# Altium schematic sheet Carte_Alimentation.SchDoc: Schema Carte Alimentation
size A3; Organization: Altium Limited; Address1: L3, 12a Rodborough Rd; Address2: Frenchs Forest; Address3: NSW; Address4: Australia 2086
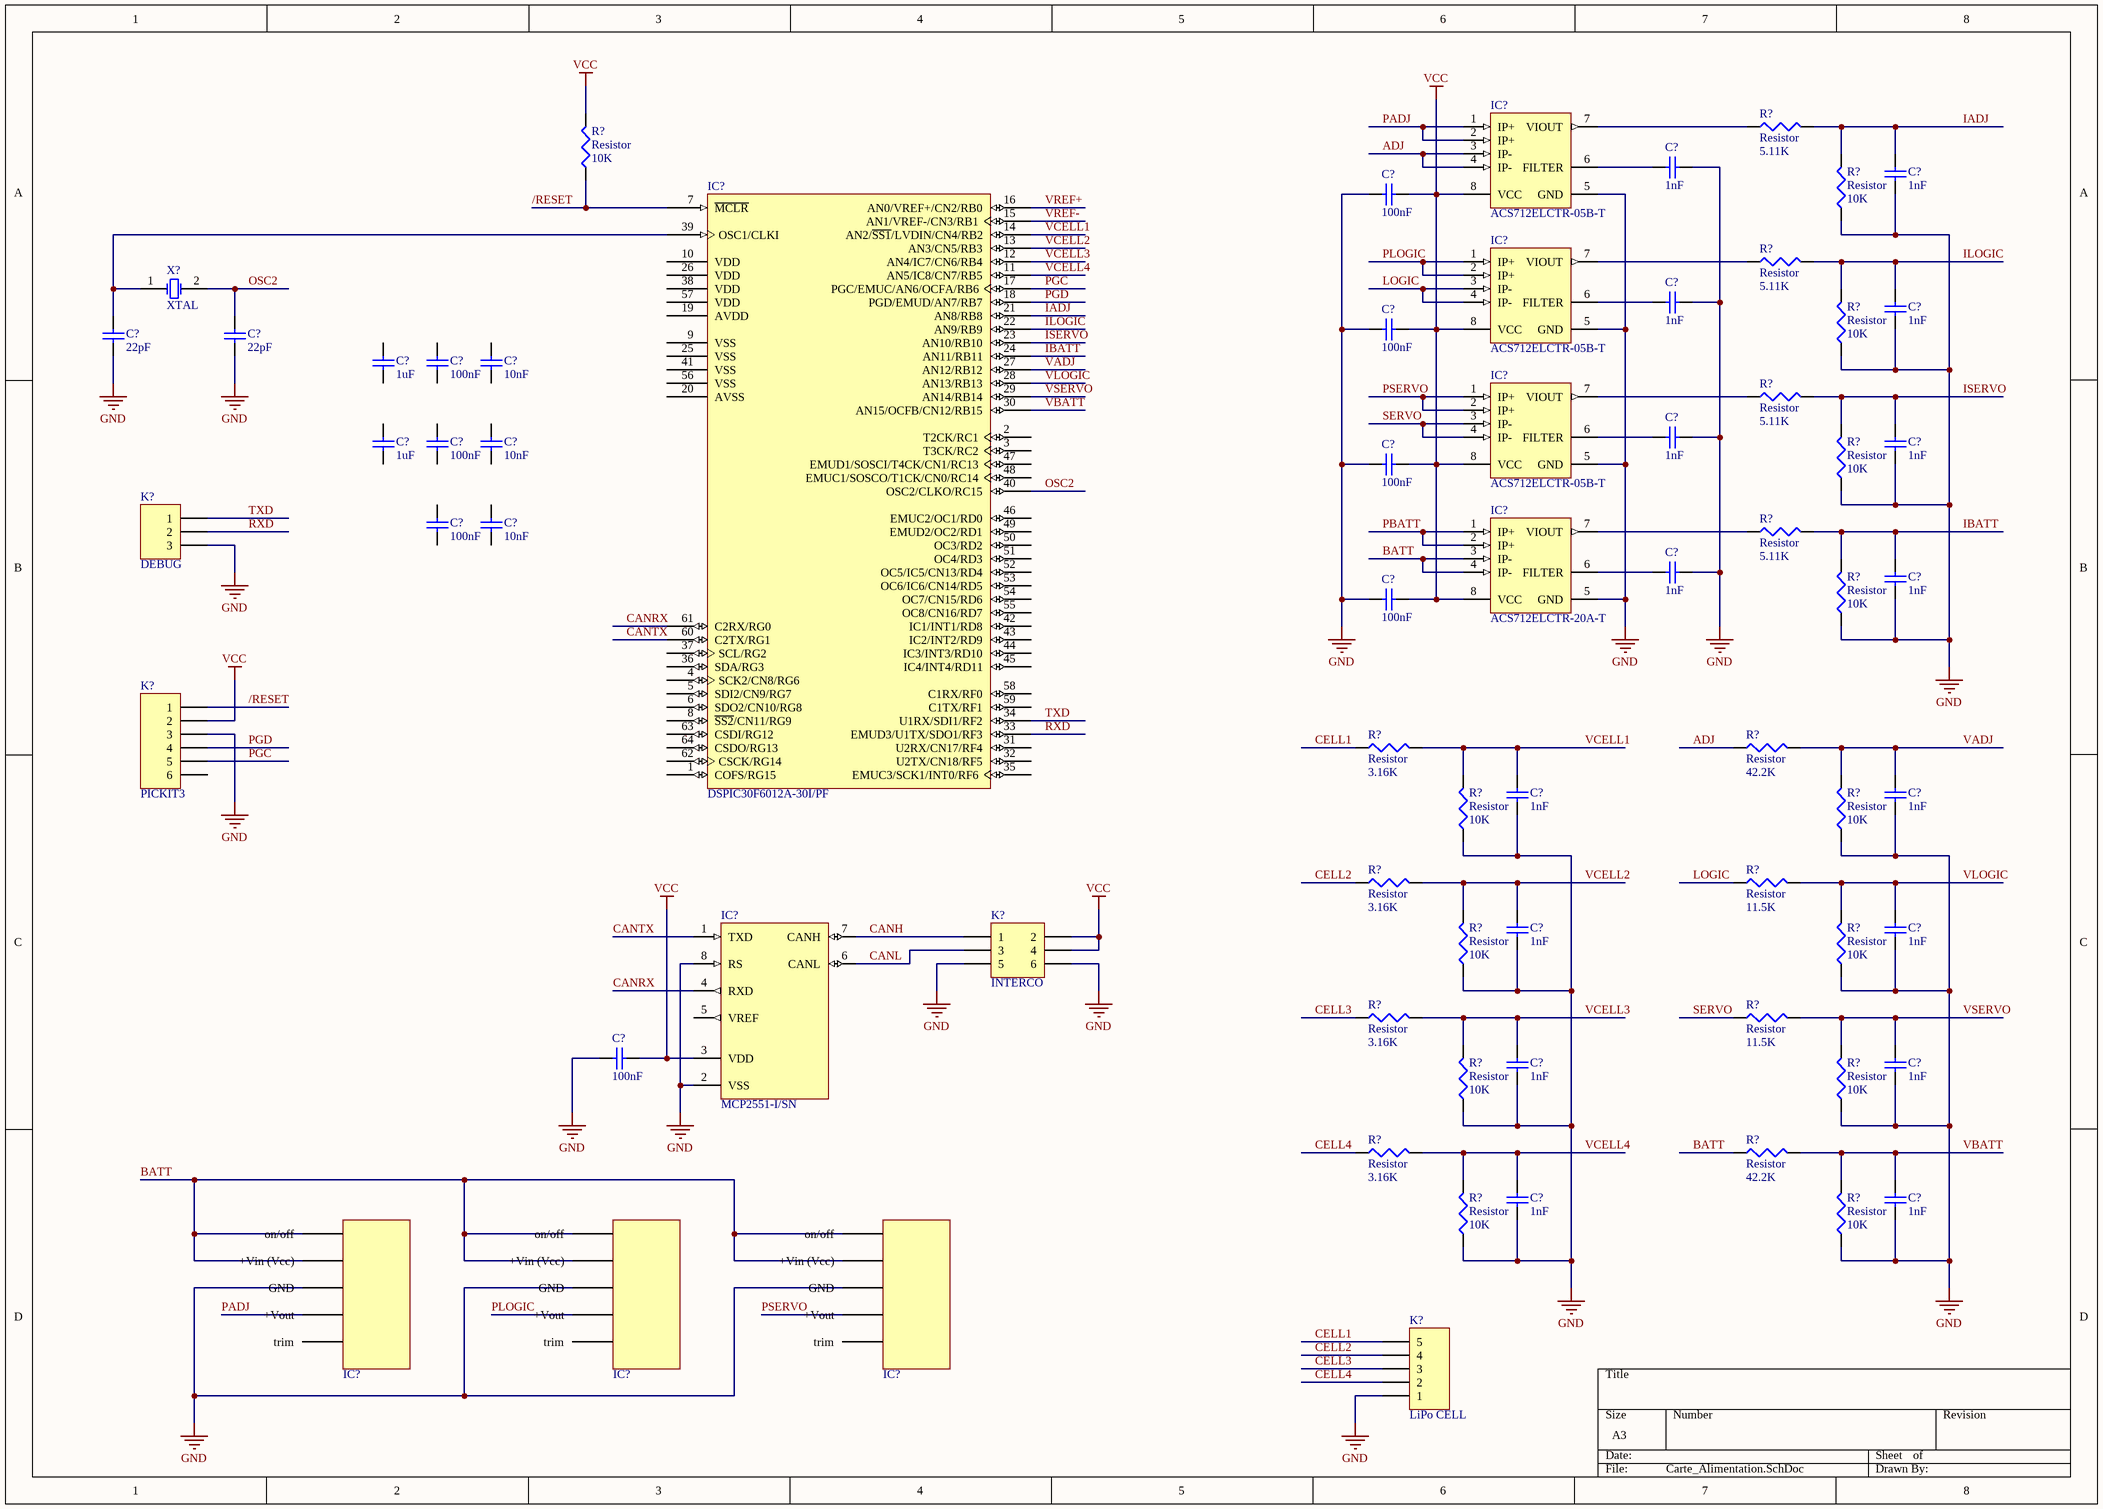
[diagram p0: Carte_Alimentation.SchDoc]

## Parts
(Parts that share a designator on the sheet are numbered #1, #2 ... from top to bottom, then left to right.)
C?#1  value 1nF  [Cap tantal 5mm pitch]  (hidden comment: Capacitor tantal)
C?#2  value 1nF  [Cap tantal 5mm pitch]  (hidden comment: Capacitor tantal)
C?#3  value 100nF  [Cap tantal 5mm pitch]  (hidden comment: Capacitor tantal)
C?#4  value 1nF  [Cap tantal 5mm pitch]  (hidden comment: Capacitor tantal)
C?#5  value 1nF  [Cap tantal 5mm pitch]  (hidden comment: Capacitor tantal)
C?#6  value 22pF  [Cap tantal 5mm pitch]  (hidden comment: Capacitor tantal)
C?#7  value 22pF  [Cap tantal 5mm pitch]  (hidden comment: Capacitor tantal)
C?#8  value 100nF  [Cap tantal 5mm pitch]  (hidden comment: Capacitor tantal)
C?#9  value 1uF  [Cap tantal 5mm pitch]  (hidden comment: Capacitor tantal)
C?#10  value 100nF  [Cap tantal 5mm pitch]  (hidden comment: Capacitor tantal)
C?#11  value 10nF  [Cap tantal 5mm pitch]  (hidden comment: Capacitor tantal)
C?#12  value 1uF  [Cap tantal 5mm pitch]  (hidden comment: Capacitor tantal)
C?#13  value 100nF  [Cap tantal 5mm pitch]  (hidden comment: Capacitor tantal)
C?#14  value 10nF  [Cap tantal 5mm pitch]  (hidden comment: Capacitor tantal)
C?#15  value 1nF  [Cap tantal 5mm pitch]  (hidden comment: Capacitor tantal)
C?#16  value 1nF  [Cap tantal 5mm pitch]  (hidden comment: Capacitor tantal)
C?#17  value 100nF  [Cap tantal 5mm pitch]  (hidden comment: Capacitor tantal)
C?#18  value 100nF  [Cap tantal 5mm pitch]  (hidden comment: Capacitor tantal)
C?#19  value 10nF  [Cap tantal 5mm pitch]  (hidden comment: Capacitor tantal)
C?#20  value 1nF  [Cap tantal 5mm pitch]  (hidden comment: Capacitor tantal)
C?#21  value 1nF  [Cap tantal 5mm pitch]  (hidden comment: Capacitor tantal)
C?#22  value 100nF  [Cap tantal 5mm pitch]  (hidden comment: Capacitor tantal)
C?#23  value 1nF  [Cap tantal 5mm pitch]  (hidden comment: Capacitor tantal)
C?#24  value 1nF  [Cap tantal 5mm pitch]  (hidden comment: Capacitor tantal)
C?#25  value 1nF  [Cap tantal 5mm pitch]  (hidden comment: Capacitor tantal)
C?#26  value 1nF  [Cap tantal 5mm pitch]  (hidden comment: Capacitor tantal)
C?#27  value 100nF  [Cap tantal 5mm pitch]  (hidden comment: Capacitor tantal)
C?#28  value 1nF  [Cap tantal 5mm pitch]  (hidden comment: Capacitor tantal)
C?#29  value 1nF  [Cap tantal 5mm pitch]  (hidden comment: Capacitor tantal)
C?#30  value 1nF  [Cap tantal 5mm pitch]  (hidden comment: Capacitor tantal)
C?#31  value 1nF  [Cap tantal 5mm pitch]  (hidden comment: Capacitor tantal)
IC?#1  ACS712ELCTR-05B-T  [ALEG-LC-8_V]
IC?#2  DSPIC30F6012A-30I/PF  [TQFP-PF64_N]
IC?#3  ACS712ELCTR-05B-T  [ALEG-LC-8_V]
IC?#4  ACS712ELCTR-05B-T  [ALEG-LC-8_V]
IC?#5  ACS712ELCTR-20A-T  [ALEG-LC-8_V]
IC?#6  MCP2551-I/SN  [SOIC-SN8_N]
IC?#7  TS3-24150  [SIP-5]  (value not drawn)
IC?#8  TS3-24150  [SIP-5]  (value not drawn)
IC?#9  TS3-24150  [SIP-5]  (value not drawn)
K?#1  DEBUG  [HDR1X3]
K?#2  PICKIT3  [HDR1X6]
K?#3  INTERCO  [HDR2X3]
K?#4  LiPo CELL  [HDR1X5]
R?#1  Resistor  value 5.11K  [0402]
R?#2  Resistor  value 10K  [0402]
R?#3  Resistor  value 10K  [0402]
R?#4  Resistor  value 5.11K  [0402]
R?#5  Resistor  value 10K  [0402]
R?#6  Resistor  value 5.11K  [0402]
R?#7  Resistor  value 10K  [0402]
R?#8  Resistor  value 5.11K  [0402]
R?#9  Resistor  value 10K  [0402]
R?#10  Resistor  value 3.16K  [0402]
R?#11  Resistor  value 42.2K  [0402]
R?#12  Resistor  value 10K  [0402]
R?#13  Resistor  value 10K  [0402]
R?#14  Resistor  value 3.16K  [0402]
R?#15  Resistor  value 11.5K  [0402]
R?#16  Resistor  value 10K  [0402]
R?#17  Resistor  value 10K  [0402]
R?#18  Resistor  value 3.16K  [0402]
R?#19  Resistor  value 11.5K  [0402]
R?#20  Resistor  value 10K  [0402]
R?#21  Resistor  value 10K  [0402]
R?#22  Resistor  value 3.16K  [0402]
R?#23  Resistor  value 42.2K  [0402]
R?#24  Resistor  value 10K  [0402]
R?#25  Resistor  value 10K  [0402]
X?  XTAL  [R38]

## Nets
GND: C?#1.1 C?#2.1 C?#3.2 C?#4.1 C?#5.1 C?#6.1 C?#7.1 C?#8.2 C?#15.1 C?#16.1 C?#17.2 C?#20.1 C?#21.1 C?#22.2 C?#23.1 C?#24.1 C?#25.1 C?#26.1 C?#27.2 C?#28.1 C?#29.1 C?#30.1 C?#31.1 IC?#1.5(GND) IC?#3.5(GND) IC?#4.5(GND) IC?#5.5(GND) IC?#6.2(VSS) IC?#6.8(RS) K?#1.3 K?#2.3 K?#3.5 K?#3.6 K?#4.1 R?#3.1 R?#5.1 R?#7.1 R?#9.1 R?#12.1 R?#13.1 R?#16.1 R?#17.1 R?#20.1 R?#21.1 R?#24.1 R?#25.1
VCC: C?#3.1 C?#8.1 C?#17.1 C?#22.1 C?#27.1 IC?#1.8(VCC) IC?#3.8(VCC) IC?#4.8(VCC) IC?#5.8(VCC) IC?#6.3(VDD) K?#2.2 K?#3.2 K?#3.4 R?#2.2
/RESET: IC?#2.7(~{MCLR}) K?#2.1 R?#2.1
ADJ: IC?#1.3(IP-) IC?#1.4(IP-) R?#11.1
BATT: IC?#5.3(IP-) IC?#5.4(IP-) R?#23.1
CANH: IC?#6.7(CANH) K?#3.1
CANL: IC?#6.6(CANL) K?#3.3
CANRX: IC?#2.61(C2RX/RG0) IC?#6.4(RXD)
CANTX: IC?#2.60(C2TX/RG1) IC?#6.1(TXD)
CELL1: K?#4.5 R?#10.1
CELL2: K?#4.4 R?#14.1
CELL3: K?#4.3 R?#18.1
CELL4: K?#4.2 R?#22.1
IADJ: C?#2.2 IC?#2.21(AN8/RB8) R?#1.2 R?#3.2
IBATT: C?#21.2 IC?#2.24(AN11/RB11) R?#8.2 R?#9.2
ILOGIC: C?#5.2 IC?#2.22(AN9/RB9) R?#4.2 R?#5.2
ISERVO: C?#16.2 IC?#2.23(AN10/RB10) R?#6.2 R?#7.2
LOGIC: IC?#3.3(IP-) IC?#3.4(IP-) R?#15.1
OSC2: C?#7.2 IC?#2.40(OSC2/CLKO/RC15) X?.2(OSC2)
PADJ: IC?#1.1(IP+) IC?#1.2(IP+)
PBATT: IC?#5.1(IP+) IC?#5.2(IP+)
PGC: IC?#2.17(PGC/EMUC/AN6/OCFA/RB6) K?#2.5
PGD: IC?#2.18(PGD/EMUD/AN7/RB7) K?#2.4
PLOGIC: IC?#3.1(IP+) IC?#3.2(IP+)
PSERVO: IC?#4.1(IP+) IC?#4.2(IP+)
RXD: IC?#2.33(EMUD3/U1TX/SDO1/RF3) K?#1.2
SERVO: IC?#4.3(IP-) IC?#4.4(IP-) R?#19.1
TXD: IC?#2.34(U1RX/SDI1/RF2) K?#1.1
VADJ: C?#24.2 IC?#2.27(AN12/RB12) R?#11.2 R?#13.2
VBATT: C?#31.2 IC?#2.30(AN15/OCFB/CN12/RB15) R?#23.2 R?#25.2
VCELL1: C?#23.2 IC?#2.14(AN2/~{SS1}/LVDIN/CN4/RB2) R?#10.2 R?#12.2
VCELL2: C?#25.2 IC?#2.13(AN3/CN5/RB3) R?#14.2 R?#16.2
VCELL3: C?#28.2 IC?#2.12(AN4/IC7/CN6/RB4) R?#18.2 R?#20.2
VCELL4: C?#30.2 IC?#2.11(AN5/IC8/CN7/RB5) R?#22.2 R?#24.2
VLOGIC: C?#26.2 IC?#2.28(AN13/RB13) R?#15.2 R?#17.2
VREF+: IC?#2.16(AN0/VREF+/CN2/RB0)
VREF-: IC?#2.15(AN1/VREF-/CN3/RB1)
VSERVO: C?#29.2 IC?#2.29(AN14/RB14) R?#19.2 R?#21.2
NetC?#1_2: C?#1.2 IC?#1.6(FILTER)
NetC?#4_2: C?#4.2 IC?#3.6(FILTER)
NetC?#6_2: C?#6.2 IC?#2.39(OSC1/CLKI) X?.1(OSC1)
NetC?#15_2: C?#15.2 IC?#4.6(FILTER)
NetC?#20_2: C?#20.2 IC?#5.6(FILTER)
NetIC?#1_7: IC?#1.7(VIOUT) R?#1.1
NetIC?#3_7: IC?#3.7(VIOUT) R?#4.1
NetIC?#4_7: IC?#4.7(VIOUT) R?#6.1
NetIC?#5_7: IC?#5.7(VIOUT) R?#8.1

Not connected (* = marked no-connect by the designer): C?#9 1 2; C?#10 1 2; C?#11 1 2; C?#12 1 2; C?#13 1 2; C?#14 1 2; C?#18 1 2; C?#19 1 2; IC?#2 1(COFS/RG15) 2(T2CK/RC1) 3(T3CK/RC2) 4(SCK2/CN8/RG6) 5(SDI2/CN9/RG7) 6(SDO2/CN10/RG8) 8(~{SS2}/CN11/RG9) 9(VSS) 10(VDD) 19(AVDD) 20(AVSS) 25(VSS) 26(VDD) 31(U2RX/CN17/RF4) 32(U2TX/CN18/RF5) 35(EMUC3/SCK1/INT0/RF6) 36(SDA/RG3) 37(SCL/RG2) 38(VDD) 41(VSS) 42(IC1/INT1/RD8) 43(IC2/INT2/RD9) 44(IC3/INT3/RD10) 45(IC4/INT4/RD11) 46(EMUC2/OC1/RD0) 47(EMUD1/SOSCI/T4CK/CN1/RC13) 48(EMUC1/SOSCO/T1CK/CN0/RC14) 49(EMUD2/OC2/RD1) 50(OC3/RD2) 51(OC4/RD3) 52(OC5/IC5/CN13/RD4) 53(OC6/IC6/CN14/RD5) 54(OC7/CN15/RD6) 55(OC8/CN16/RD7) 56(VSS) 57(VDD) 58(C1RX/RF0) 59(C1TX/RF1) 62(CSCK/RG14) 63(CSDI/RG12) 64(CSDO/RG13); IC?#6 5(VREF); IC?#7 12(+Vin_(Vcc)) 13(GND) 14(+Vout) 15(trim) ?1(on/off); IC?#8 12(+Vin_(Vcc)) 13(GND) 14(+Vout) 15(trim) ?1(on/off); IC?#9 12(+Vin_(Vcc)) 13(GND) 14(+Vout) 15(trim) ?1(on/off); K?#2 6

## Notes on the sheet
- Title
- Size:
- Date:
- A4
- Number:
- Time:
- Revision:
- Sheet
- of
- File:

## Library data of the parts
C?#1-C?#31 = Capacitor tantal: Capacitor; Published: 8-Jun-2000; LatestRevisionDate: 29-May-2009; LatestRevisionNote: IPC-7351 Footprint Added.; PackageReference: C0805; Publisher: Altium Limited; PackageDescription: Chip Capacitor
IC?#1 IC?#3 IC?#4 = CMP-0826-00001-1: Linear Current Sensor IC, 4.5 to 5.5 V Supply Voltage, 10 mA Supply Current, -40 to 85 degC, 8-Pin SOIC (LC), RoHS, Tape and Reel; Manufacturer: Allegro Microsystems; PartNumber: ACS712ELCTR-20A-T; CLOAD: 10 nF Max.; ICC: 10 mA; F: 80 kHz; RLOAD: 4.7 kOhm Min.; Optimized Accuracy Range: +/- 20 A; TR: 3.5 us; Sensitivity Sens: 100 mV/A Typ.; Operating Temperature Range: -40 to 85 degC; ComponentLink2URL: http://www.allegromicro.com/~/media/Files/Datasheets/ACS712-Datasheet.ashx; ComponentLink1Description: Manufacturer URL; VCC: 4.5 to 5.5 V; Mounting Technology: Surface Mount; DatasheetVersion: Rev. 15; ComponentLink2Description: Datasheet; ComponentLink1URL: http://www.allegromicro.com/; PackageDescription: 8-Pin SOIC, Body 4.9 x 3.9 mm, Pitch 1.27 mm; PackageReference: LC-8; RoHS: TRUE; Packing: Tape and Reel
IC?#2 = DSPIC30F6012A-30I/PF: High-Performance 16-bit Digital Signal Controller, 144 KB Flash, 8 KB SRAM, 4 KB EEPROM, 64-Pin TQFP, Industrial Temperature; Published: 29-Jan-2009; DatasheetVersion: revD, Jul-2008; PackageVersion: revBB, Aug-2009; PackageReference: TQFP-PF64; Publisher: Altium Limited; PackageDescription: 64-Lead Plastic Thin Quad Flatpack (PF) - 14x14x1mm Body, 2.00mm [TQFP]; Supplier 1: Digi-Key; Supplier Part Number 1: DSPIC30F6012A-30I/PF-ND; Supplier 2: Farnell; Supplier Part Number 2: 1262779; Supplier 3: Farnell; Supplier Part Number 3: 1467795; Code_JEDEC: MS-026-AEB; ComponentLink1Description: Datasheet; ComponentLink1URL: http://ww1.microchip.com/downloads/en/DeviceDoc/70143D.pdf; ComponentLink2Description: Packaging Specification; ComponentLink2URL: http://www.microchip.com/stellent/groups/techpub_sg/documents/packagingspec/en012702.pdf; ComponentLink3Description: Microchip.com Home; ComponentLink3URL: http://www.microchip.com/
IC?#5 = CMP-0826-00001-1: Linear Current Sensor IC, 4.5 to 5.5 V Supply Voltage, 10 mA Supply Current, -40 to 85 degC, 8-Pin SOIC (LC), RoHS, Tape and Reel; Manufacturer: Allegro Microsystems; CLOAD: 10 nF Max.; ICC: 10 mA; F: 80 kHz; RLOAD: 4.7 kOhm Min.; Optimized Accuracy Range: +/- 20 A; TR: 3.5 us; Sensitivity Sens: 100 mV/A Typ.; Operating Temperature Range: -40 to 85 degC; ComponentLink2URL: http://www.allegromicro.com/~/media/Files/Datasheets/ACS712-Datasheet.ashx; ComponentLink1Description: Manufacturer URL; VCC: 4.5 to 5.5 V; Mounting Technology: Surface Mount; DatasheetVersion: Rev. 15; ComponentLink2Description: Datasheet; ComponentLink1URL: http://www.allegromicro.com/; PackageDescription: 8-Pin SOIC, Body 4.9 x 3.9 mm, Pitch 1.27 mm; PackageReference: LC-8; RoHS: TRUE; Packing: Tape and Reel; PartNumber: ACS712ELCTR-20A-T
IC?#6 = MCP2551-I/SN: High-Speed CAN Transceiver, 8-Pin SOIC, Industrial Temperature; Published: 29-Jan-2009; DatasheetVersion: revE, Jan-2007; PackageVersion: revBB, Aug-2009; PackageReference: SOIC-SN8; Publisher: Altium Limited; PackageDescription: 8-Lead Plastic Small Outline (SN) - Narrow, 3.90mm Body [SOIC]; Supplier 1: Digi-Key; Supplier Part Number 1: MCP2551-I/SN-ND; Supplier 2: Farnell; Supplier Part Number 2: 9758569; Code_JEDEC: MS-012; Code_IPC: SOIC127P600-8; ComponentLink1Description: Datasheet; ComponentLink1URL: http://ww1.microchip.com/downloads/en/DeviceDoc/21667E.pdf; ComponentLink2Description: Packaging Specification; ComponentLink2URL: http://www.microchip.com/stellent/groups/techpub_sg/documents/packagingspec/en012702.pdf; ComponentLink3Description: Microchip.com Home; ComponentLink3URL: http://www.microchip.com/
K?#1 = Header 3: Header, 3-Pin; LatestRevisionDate: 17-Jul-2002; LatestRevisionNote: Re-released for DXP Platform.; Publisher: Altium Limited
K?#2 = Header 6: Header, 6-Pin; LatestRevisionDate: 17-Jul-2002; LatestRevisionNote: Re-released for DXP Platform.; Publisher: Altium Limited
K?#3 = Header 3X2: Header, 3-Pin, Dual row; LatestRevisionDate: 17-Jul-2002; LatestRevisionNote: Re-released for DXP Platform.; Publisher: Altium Limited
K?#4 = Header 5: Header, 5-Pin; LatestRevisionDate: 17-Jul-2002; LatestRevisionNote: Re-released for DXP Platform.; Publisher: Altium Limited
X? = XTAL: Crystal Oscillator; Published: 8-Jun-2000; LatestRevisionDate: 17-Jul-2002; LatestRevisionNote: Re-released for DXP Platform.; PackageReference: R38; Publisher: Altium Limited; PackageDescription: Crystal, Thru-Hole; 2 Leads; Body 3.1 x 8.2 mm (Dia.xH)
R?#1-R?#25 = Resistor: Published: 8-Jun-2000; LatestRevisionDate: 29-May-2009; LatestRevisionNote: IPC-7351 Footprint Added.; PackageReference: J1-0603; Publisher: Altium Limited; PackageDescription: Chip Resistor